# EAGLE schematic fit-test-2 (EAGLE 9.1.3)

## Sheet 1 of 5
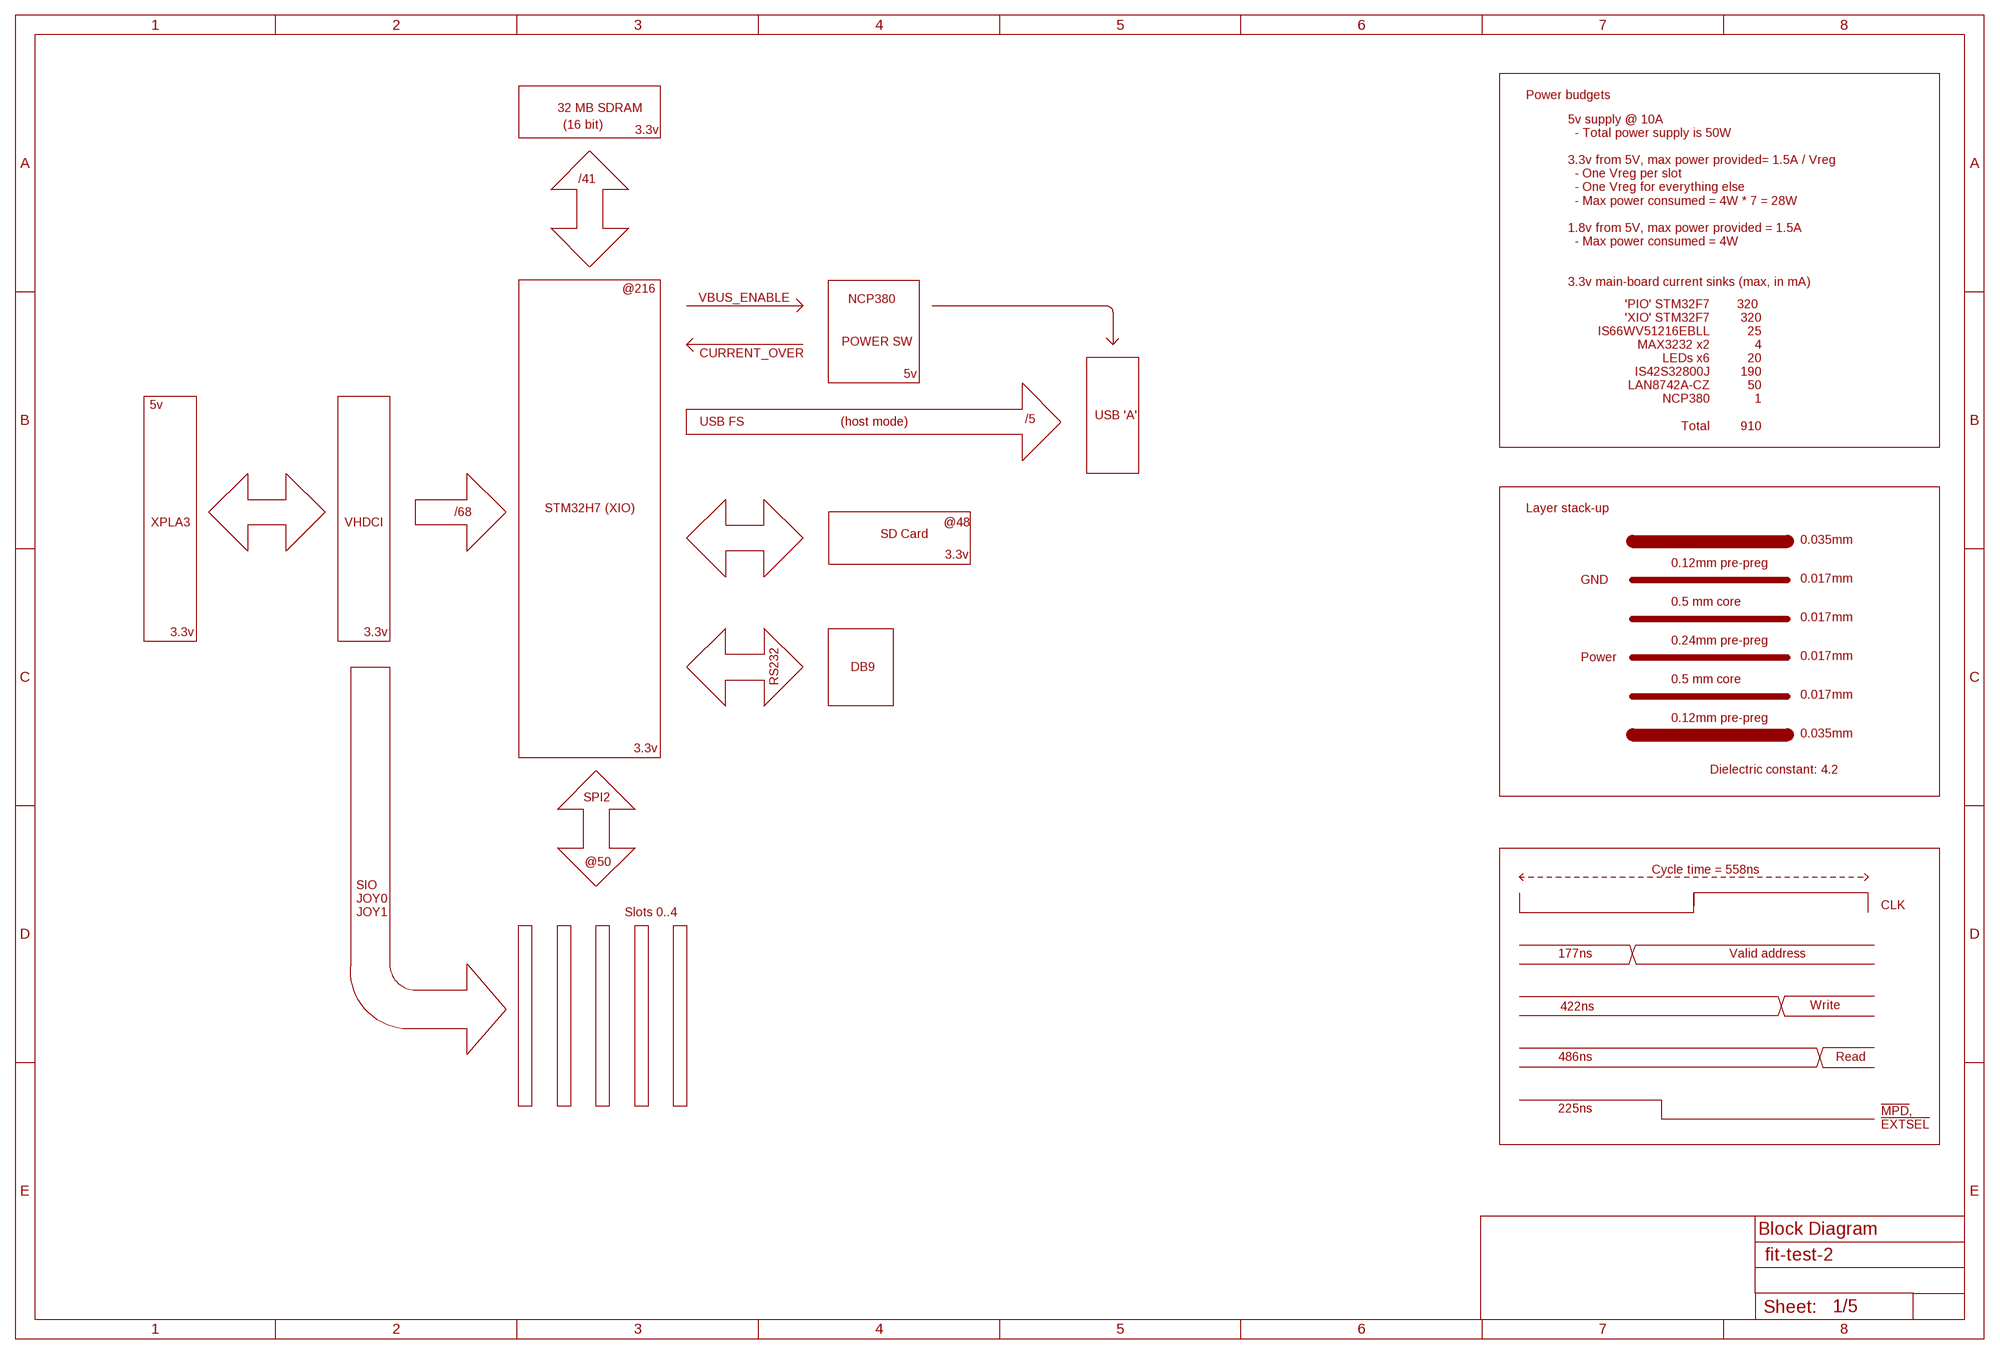
[diagram p0: schematic, sheet 1]

### Notes on the sheet
- Power budgets
- 32 MB SDRAM
- (16 bit)
- 3.3v
- /41
- 5v supply @ 10A
    - Total power supply is 50W
  
  3.3v from 5V, max power provided= 1.5A / Vreg
    - One Vreg per slot
    - One Vreg for everything else
    - Max power consumed = 4W * 7 = 28W 
  
  1.8v from 5V, max power provided = 1.5A
    - Max power consumed = 4W 
  
  
  3.3v main-board current sinks (max, in mA)
- @216 | VBUS_ENABLE
- 'PIO' STM32F7
  'XIO' STM32F7
  IS66WV51216EBLL
  MAX3232 x2
  LEDs x6
  IS42S32800J
  LAN8742A-CZ
  NCP380
  
  Total
- 320 
  320
  25
  4
  20
  190
  50
  1
  
  910
- NCP380
- POWER SW
- CURRENT_OVER
- 5v
- 5v
- USB 'A'
- USB FS | (host mode) | /5
- STM32H7 (XIO) | Layer stack-up
- /68
- XPLA3 | VHDCI | @48
- SD Card
- 0.035mm
- 3.3v
- 0.12mm pre-preg
- GND | 0.017mm
- 0.5 mm core
- 0.017mm
- 3.3v | 3.3v
- 0.24mm pre-preg
- Power | 0.017mm
- DB9
- RS232 | 0.5 mm core
- 0.017mm
- 0.12mm pre-preg
- 0.035mm
- 3.3v
- Dielectric constant: 4.2
- SPI2
- @50
- Cycle time = 558ns
- CLK
- SIO
  JOY0
  JOY1
- Slots 0..4
- 177ns | Valid address
- 422ns | Write
- 486ns | Read
- 225ns
- !MPD!,
  !EXTSEL!
- Block Diagram

## Sheet 2 of 5: XIO Power
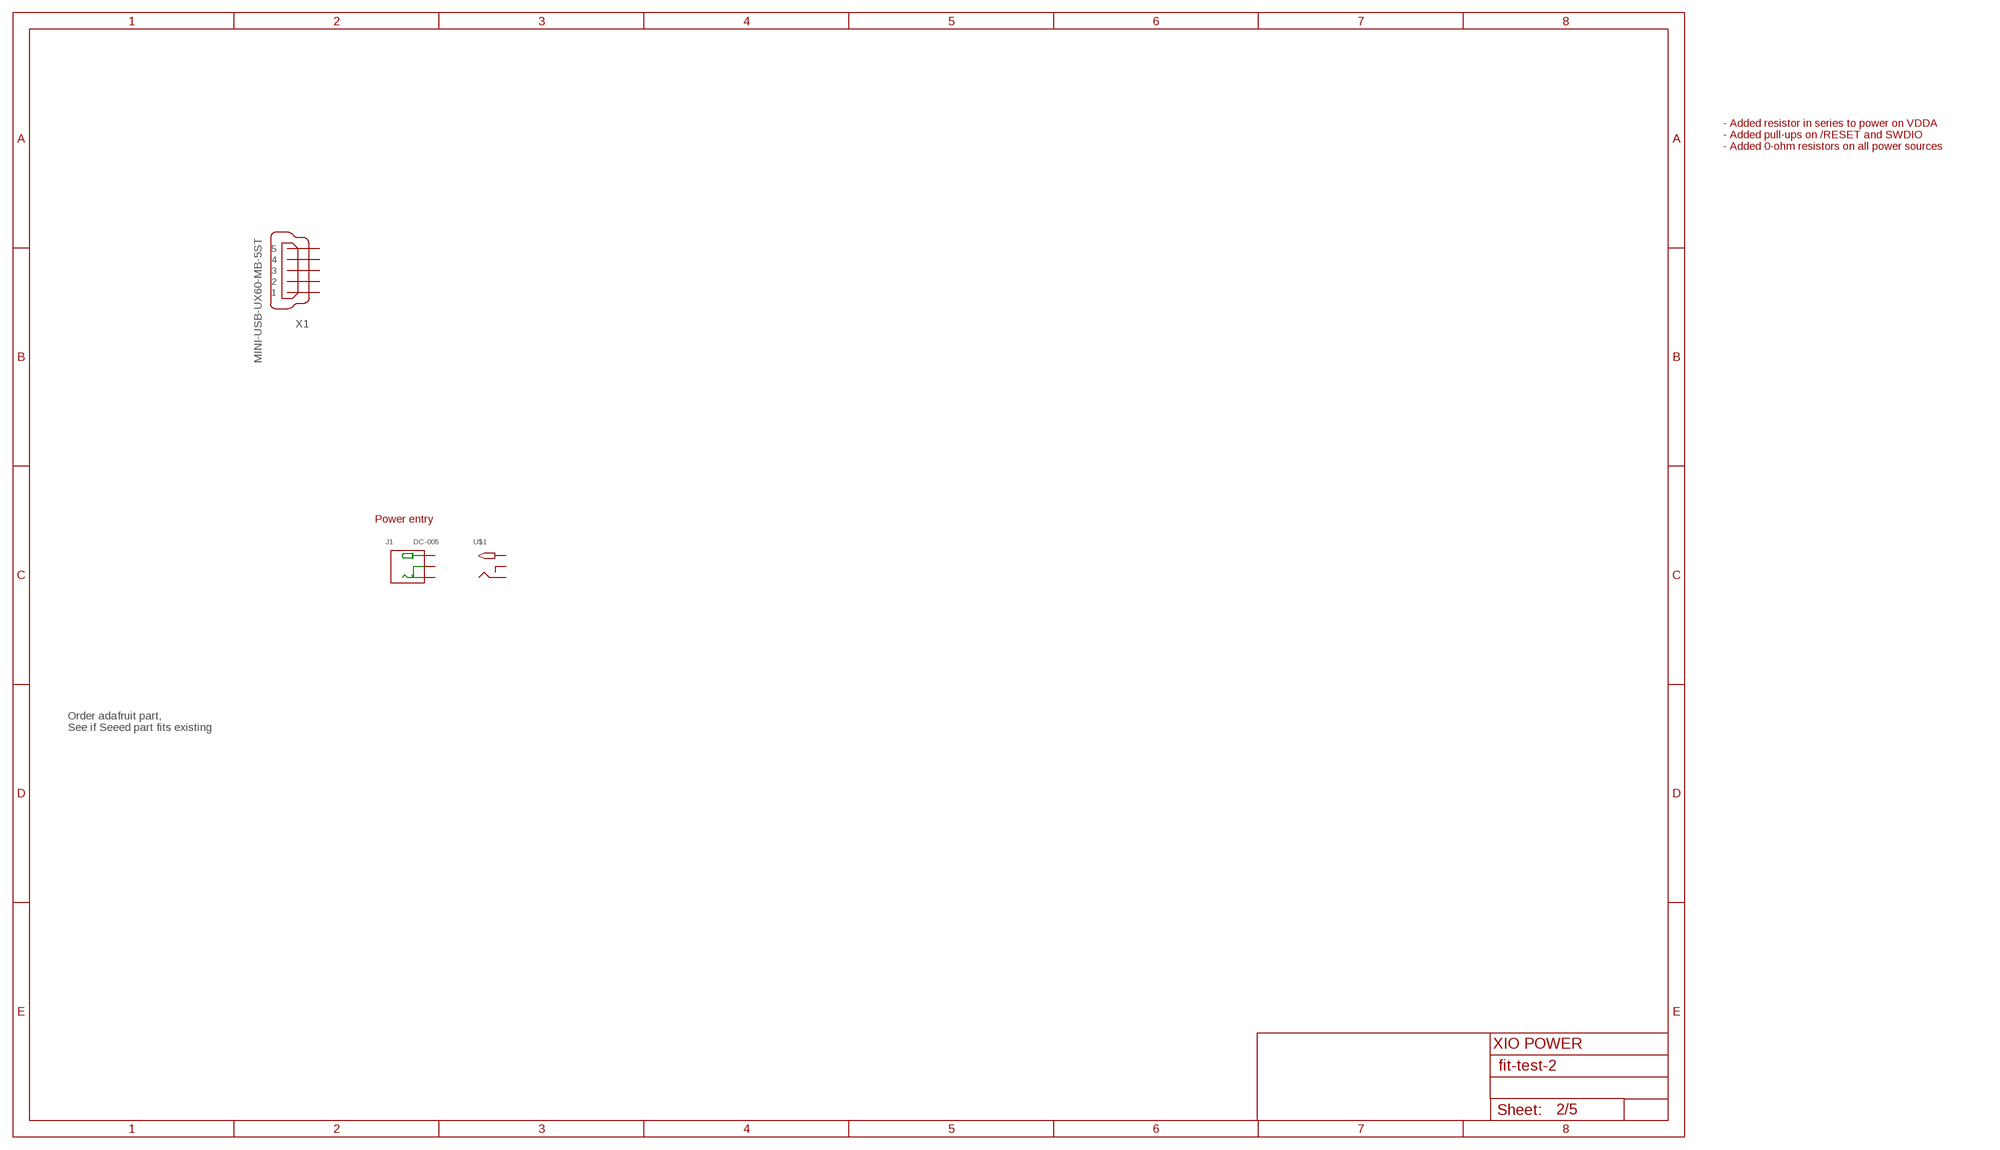
[diagram p1: schematic, sheet 2]

### Parts
J1  DC-005  CONN-POWER-JACK-2.1MM(DC-005)  [DCJ3P-14.2X11.0X9.0MM]
U$1  2.1MMJACKSMT  [DCJACK_2MM_SMT]
X1  MINI-USB-UX60-MB-5ST  [UX60-MB-5ST]
Unconnected: J1.+ J1.-1(-) J1.-2(CDN) U$1.GND(RING) U$1.GNDBREAK(RING_SW) U$1.PWR2(TIP) X1.1 X1.2 X1.3 X1.4 X1.5

### Notes on the sheet
- - Added resistor in series to power on VDDA
  - Added pull-ups on /RESET and SWDIO
  - Added 0-ohm resistors on all power sources
- Power entry
- Order adafruit part, 
  See if Seeed part fits existing
- XIO POWER

## Sheet 3 of 5: XIO VHDCI interface
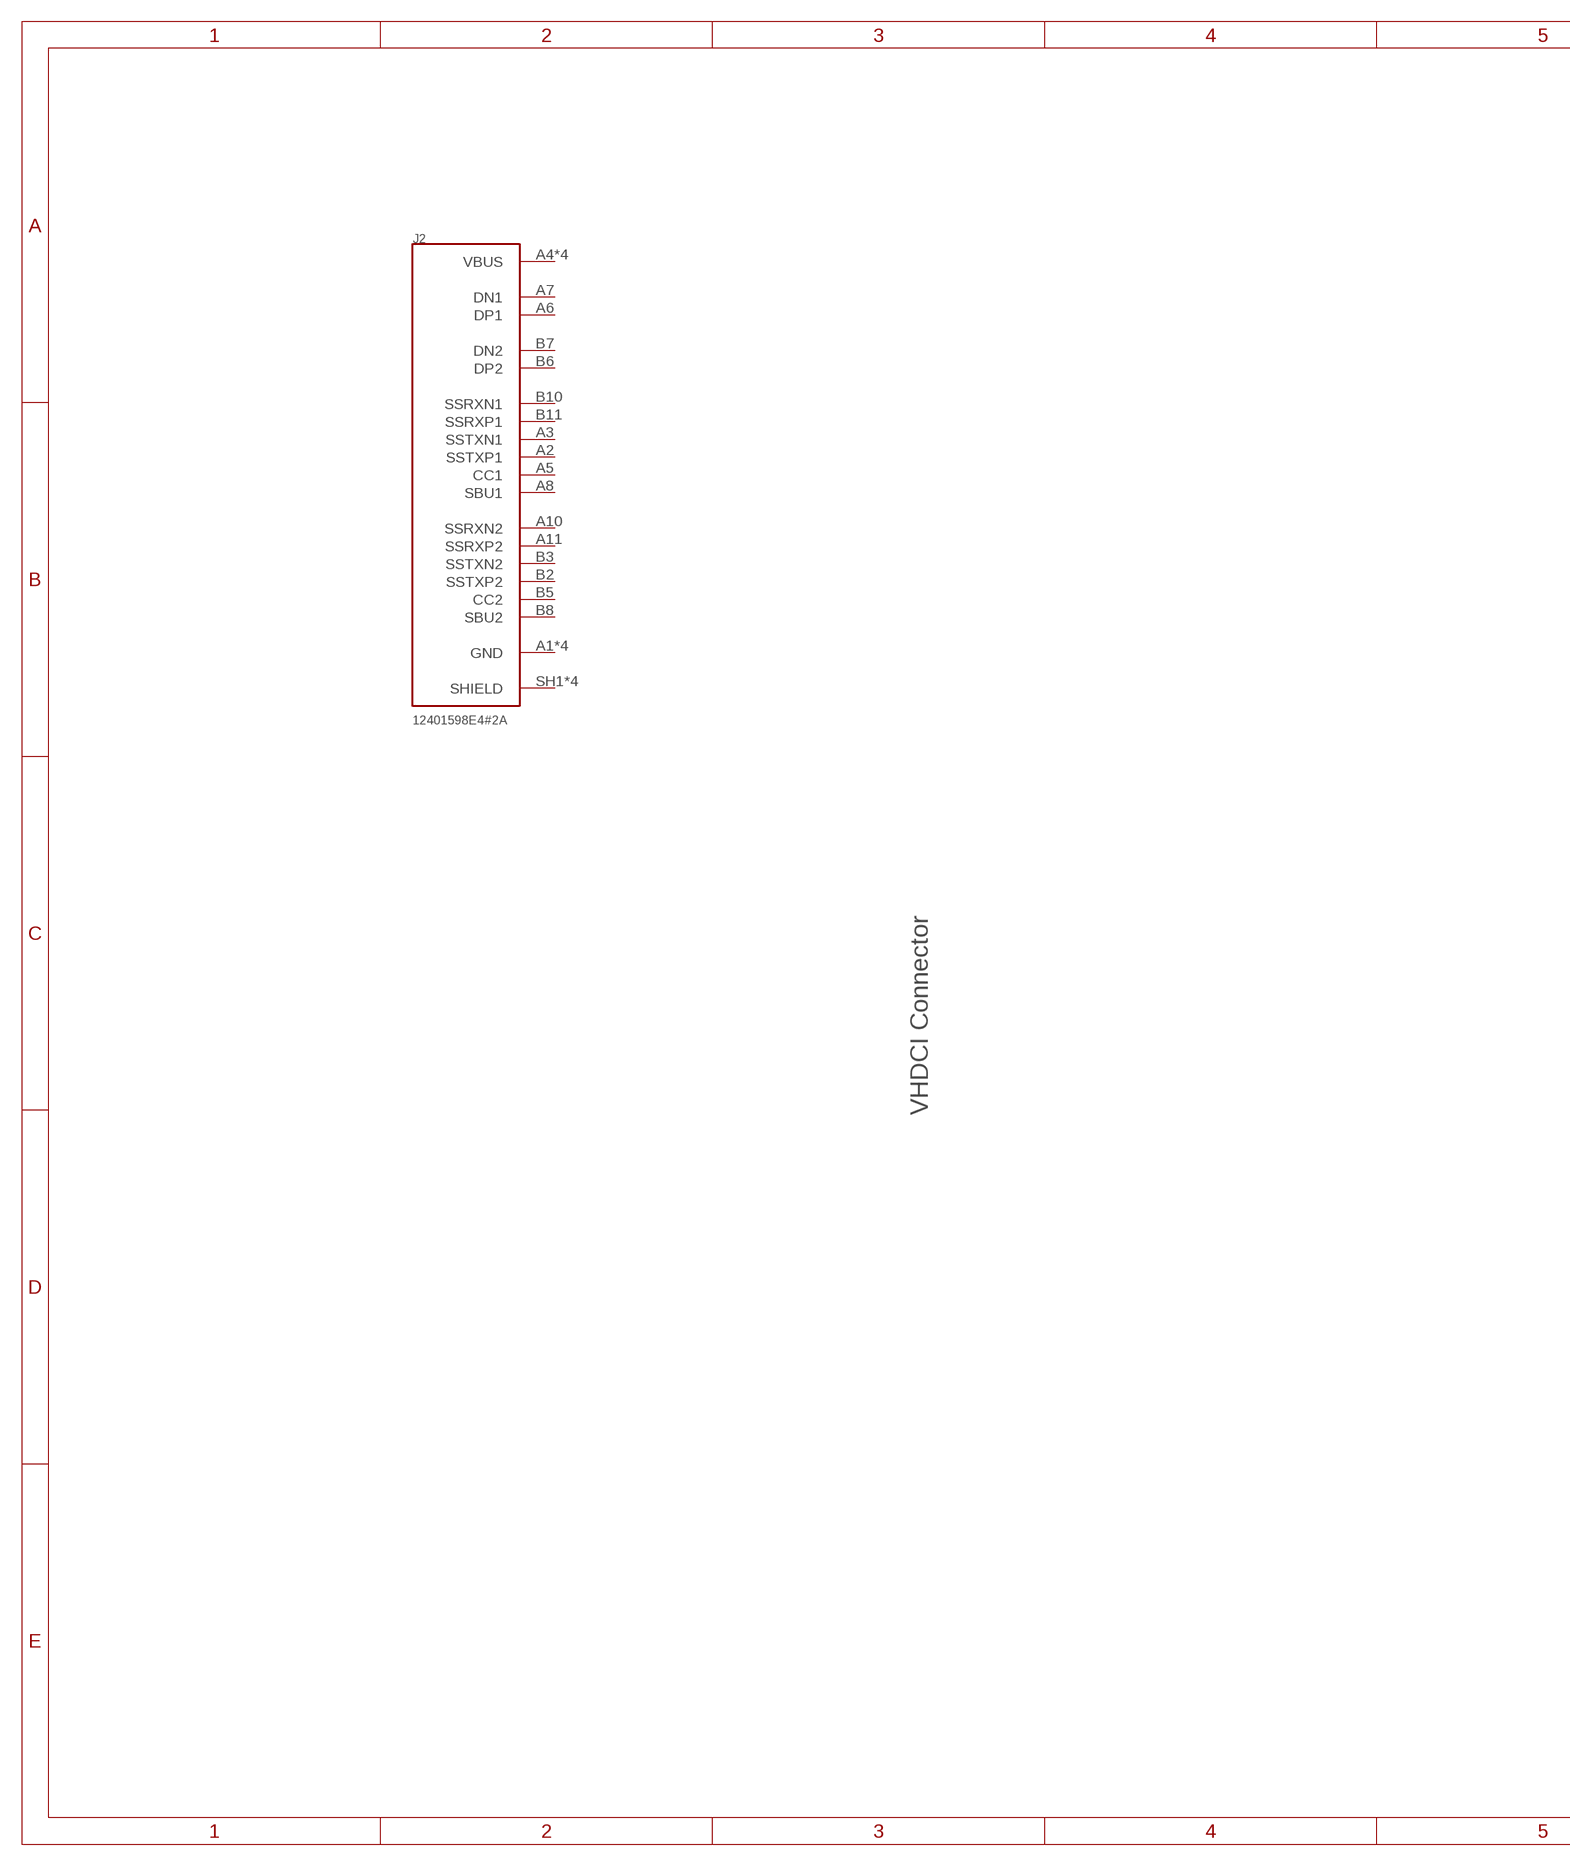
[diagram p2: schematic, sheet 3, part 1 of 2]
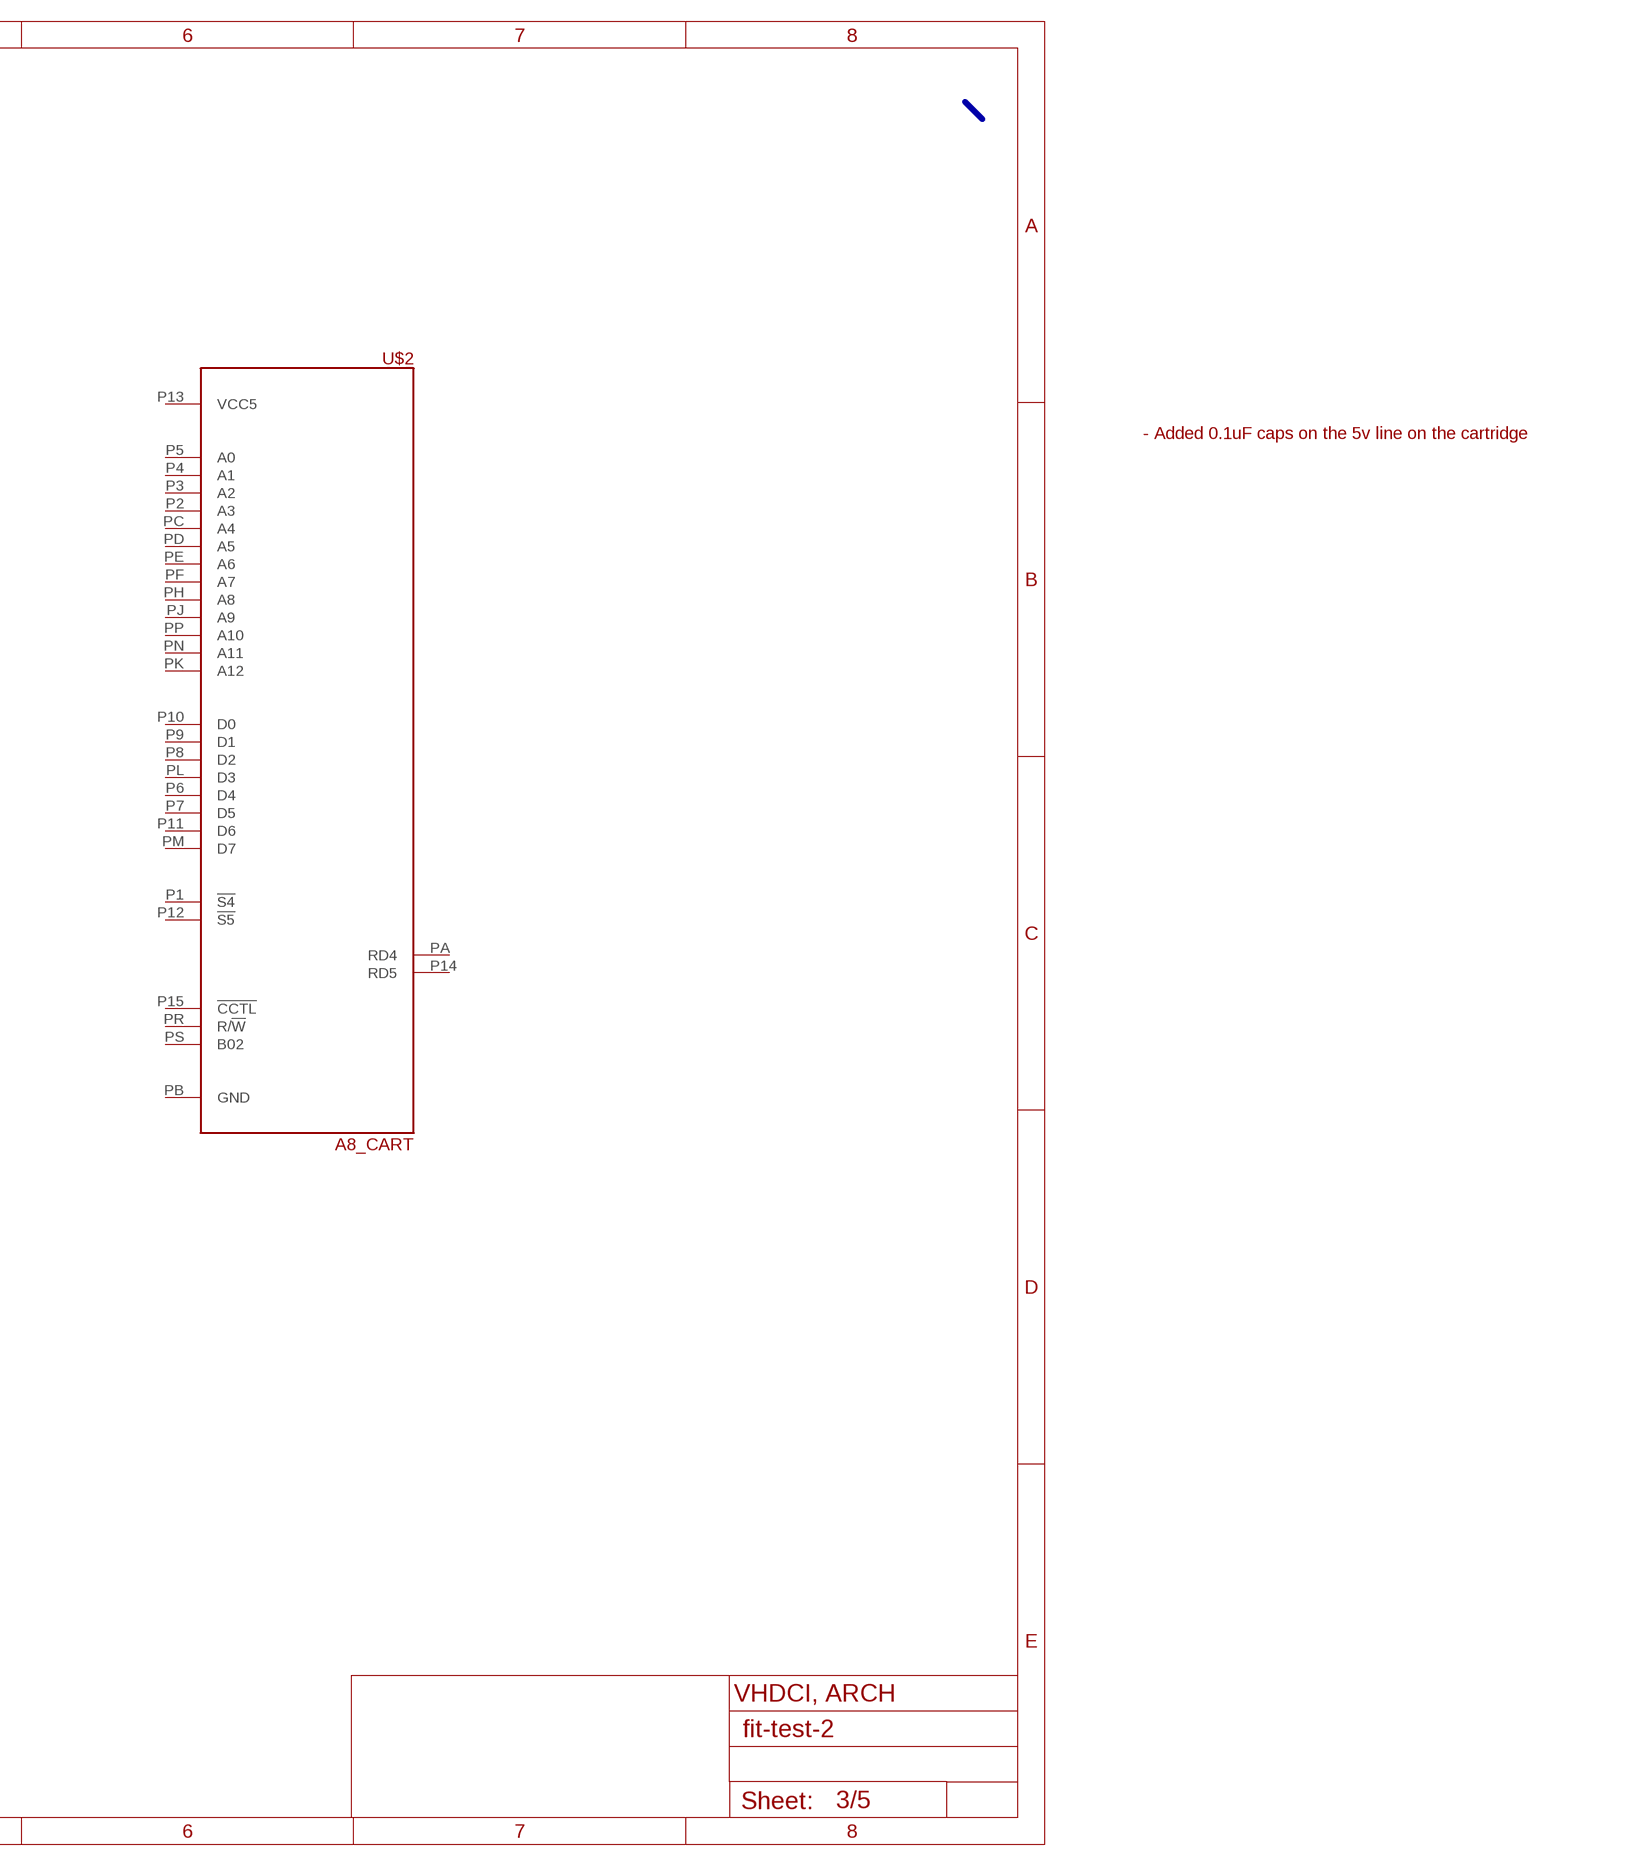
[diagram p3: schematic, sheet 3, part 2 of 2]

### Parts
J2  12401598E4#2A  [AMPHENOL_12401598E4#2A]
U$2  A8_CART  [A8_CART]
Unconnected: J2.A1(GND) J2.A2(SSTXP1) J2.A3(SSTXN1) J2.A4(VBUS) J2.A5(CC1) J2.A6(DP1) J2.A7(DN1) J2.A8(SBU1) J2.A9(VBUS) J2.A10(SSRXN2) J2.A11(SSRXP2) J2.A12(GND) J2.B1(GND) J2.B2(SSTXP2) J2.B3(SSTXN2) J2.B4(VBUS) J2.B5(CC2) J2.B6(DP2) J2.B7(DN2) J2.B8(SBU2) J2.B9(VBUS) J2.B10(SSRXN1) J2.B11(SSRXP1) J2.B12(GND) J2.SH1(SHIELD) J2.SH2(SHIELD) J2.SH3(SHIELD) J2.SH4(SHIELD) U$2.P1(!S4!) U$2.P2(A3) U$2.P3(A2) U$2.P4(A1) U$2.P5(A0) U$2.P6(D4) U$2.P7(D5) U$2.P8(D2) U$2.P9(D1) U$2.P10(D0) U$2.P11(D6) U$2.P12(!S5!) U$2.P13(VCC5) U$2.P14(RD5) U$2.P15(!CCTL!) U$2.PA(RD4) U$2.PB(GND) U$2.PC(A4) U$2.PD(A5) U$2.PE(A6) U$2.PF(A7) U$2.PH(A8) U$2.PJ(A9) U$2.PK(A12) U$2.PL(D3) U$2.PM(D7) U$2.PN(A11) U$2.PP(A10) U$2.PR(R/!W!) U$2.PS(B02)

### Buses
VHDCI:VHDCI_A[0..15],VHDCI_AUDIO_L,VHDCI_AUDIO_R,VHDCI_AUDIO_SIO,VHDCI_CCTL,VHDCI_CLK,VHDCI_COMMAND,VHDCI_D[0..7],VHDCI_D1XX,VHDCI_DATA_OUT,!VHDCI_EXSEL!,VHDCI_GND,VHDCI_HALT,!VHDCI_IRQ!,VHDCI_J1_[1..5],VHDCI_J1_A1,VHDCI_J1_A2,VHDCI_J2_[1..5],VHDCI_J2_A1,VHDCI_J2_A2,!VHDCI_MPD!,VHDCI_MTR_CTRL,VHDCI_RD4,VHDCI_RD5,VHDCI_REF,VHDCI_RSRVD[0..6],VHDCI_RST,VHDCI_RW,VHDCI_S4,VHDCI_S5,VHDCI_SIO_CLK_IN,VHDCI_SIO_DATA_IN

### Notes on the sheet
- - Added 0.1uF caps on the 5v line on the cartridge
- VHDCI Connector
- VHDCI, ARCH

## Sheet 4 of 5: XIO Serial I/O
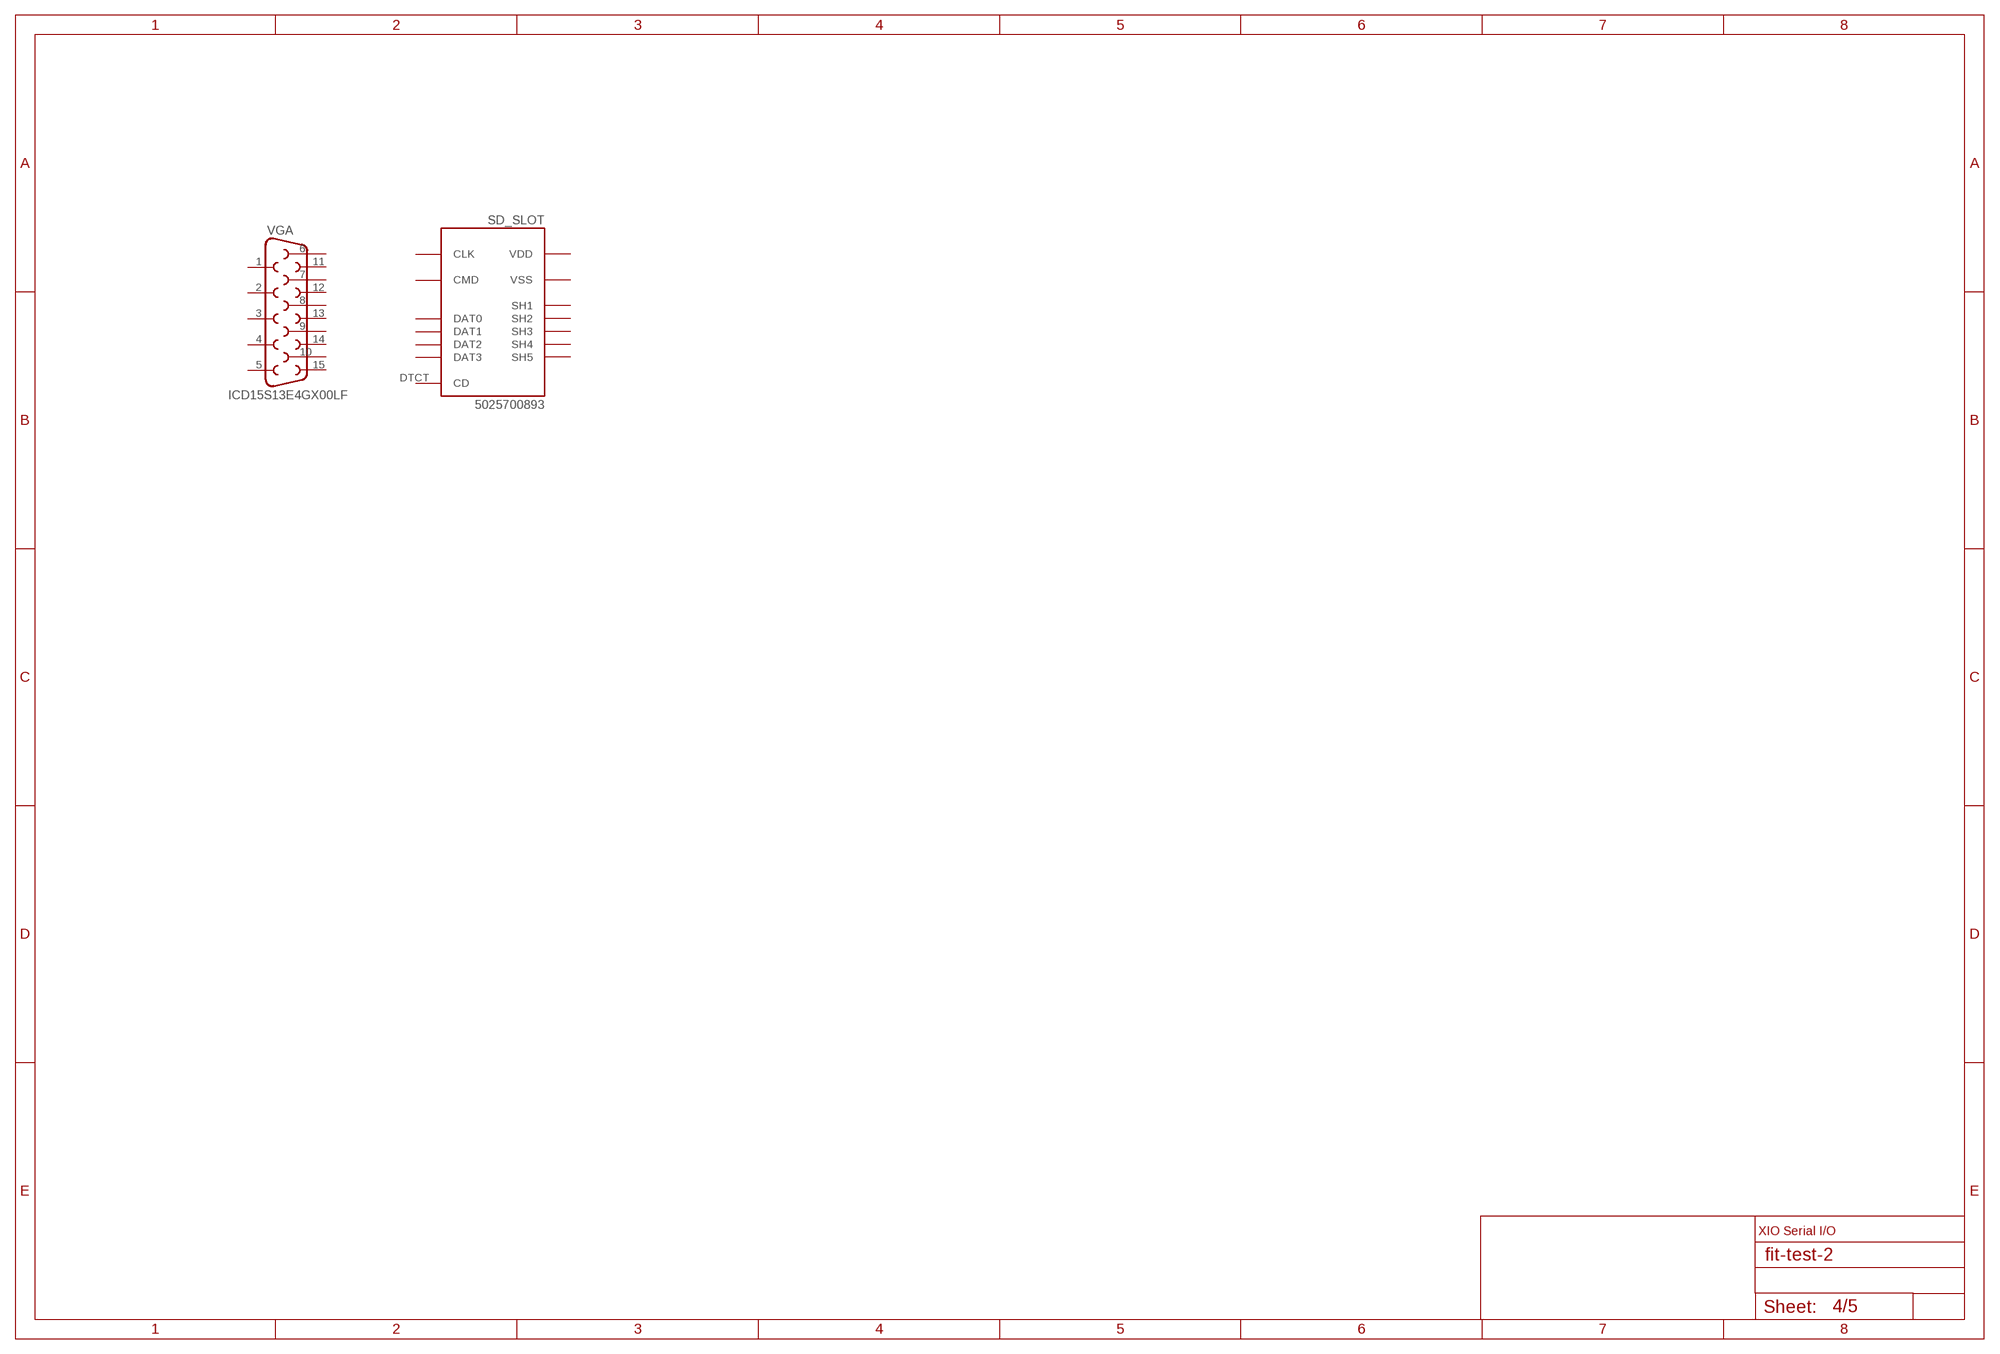
[diagram p4: schematic, sheet 4]

### Parts
SD_SLOT  5025700893  MICROSD_MOLEX_5025700893  [5025700893]
VGA  ICD15S13E4GX00LF  DB15  [DB15]
Unconnected: SD_SLOT.DTCT(CD) SD_SLOT.P$1(DAT2) SD_SLOT.P$2(DAT3) SD_SLOT.P$3(CMD) SD_SLOT.P$5(CLK) SD_SLOT.P$7(DAT0) SD_SLOT.P$8(DAT1) VGA.1 VGA.2 VGA.3 VGA.4 VGA.5 VGA.6 VGA.7 VGA.8 VGA.9 VGA.10 VGA.11 VGA.12 VGA.13 VGA.14 VGA.15

### Notes on the sheet
- XIO Serial I/O

## Sheet 5 of 5: XIO USB Host only
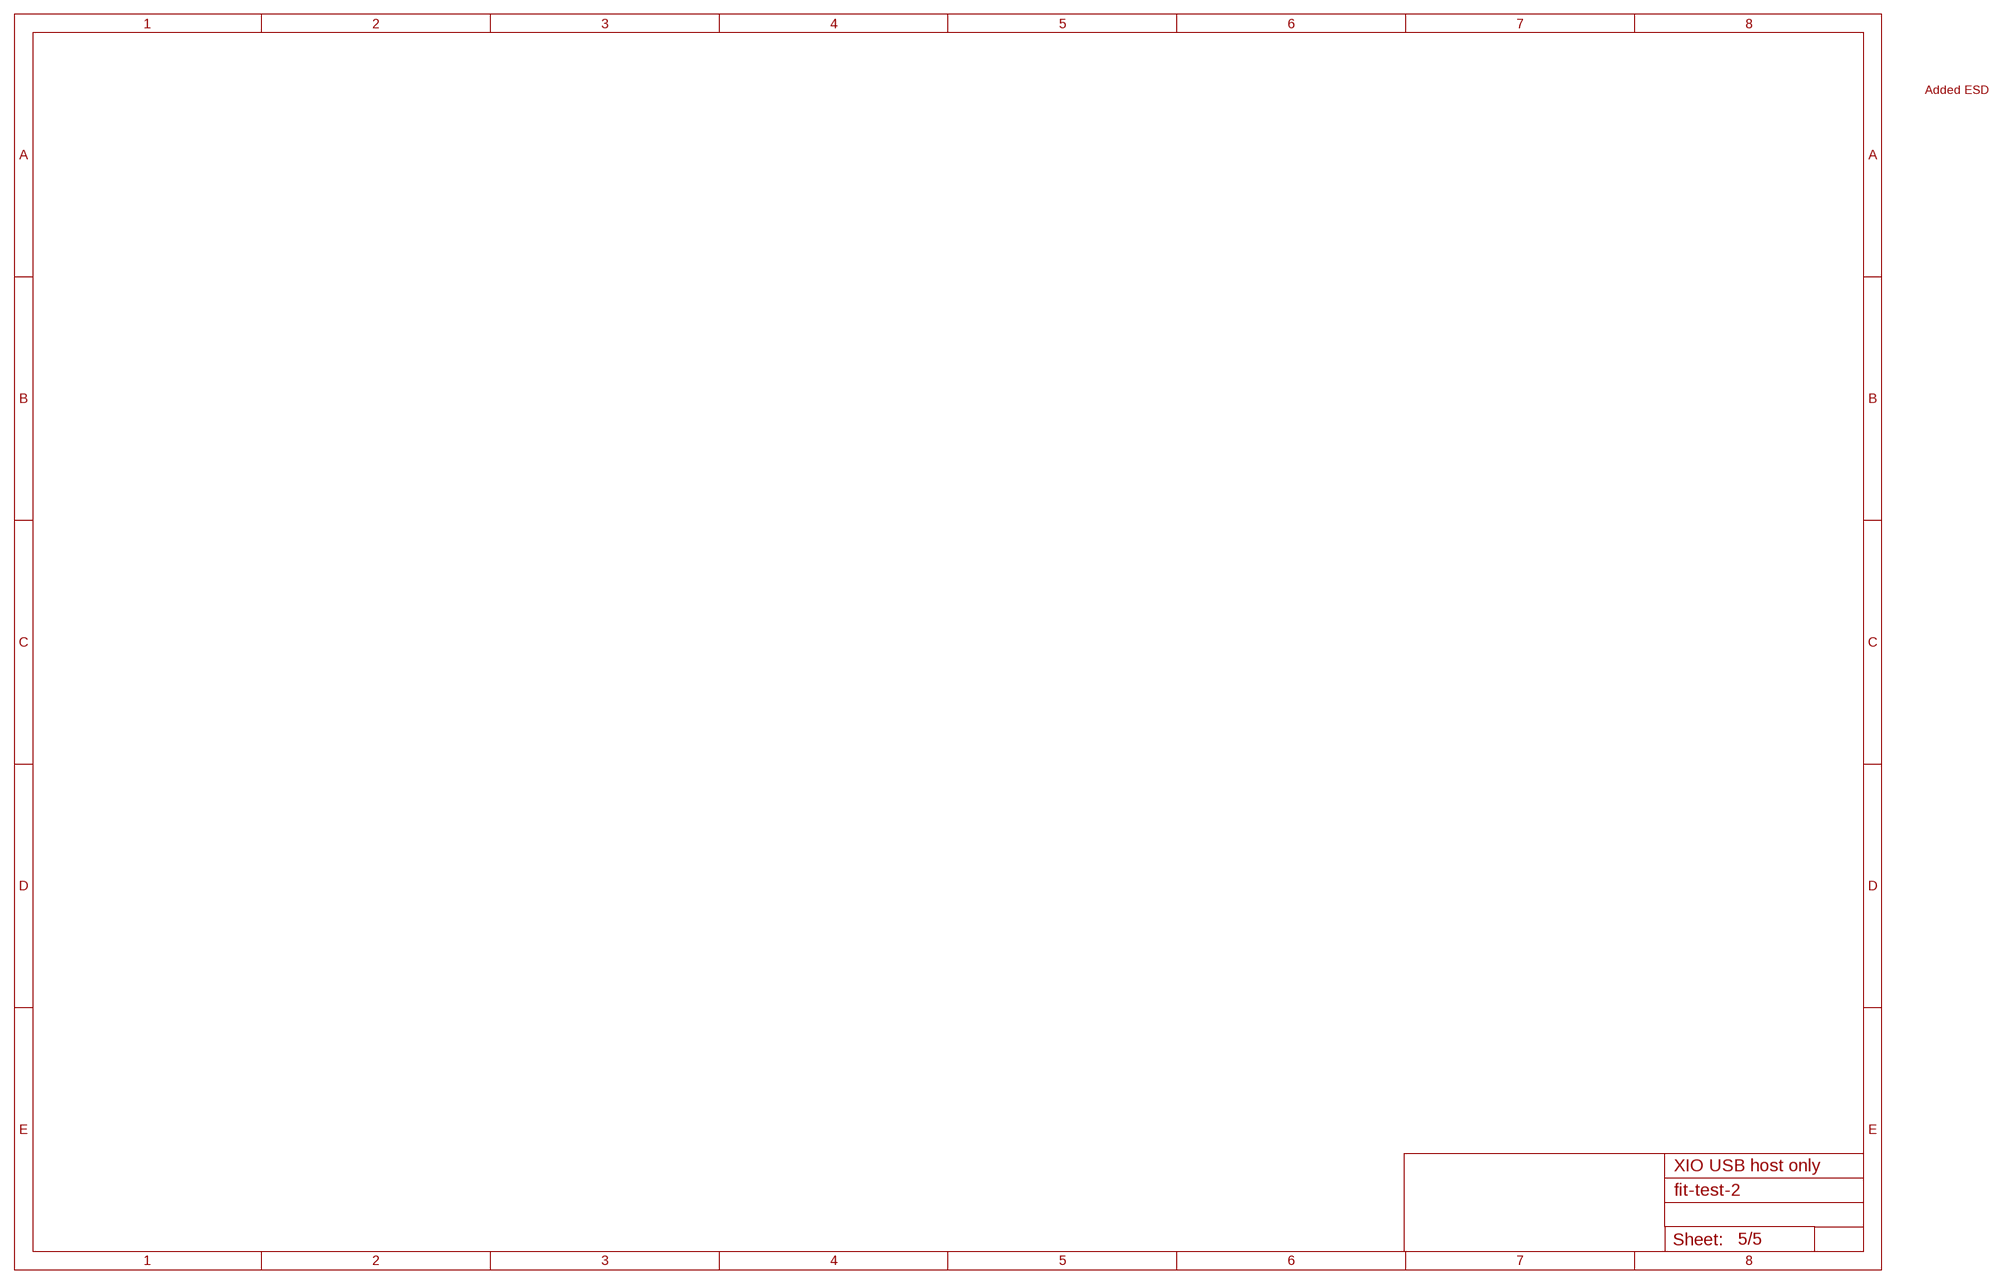
[diagram p5: schematic, sheet 5]

### Notes on the sheet
- Added ESD
- XIO USB host only

## Power pins joined to a net without a drawn wire
SH1: SD_SLOT.GND0(SH1)
SH2: SD_SLOT.GND1(SH2)
SH3: SD_SLOT.GND2(SH3)
SH4: SD_SLOT.GND3(SH4)
SH5: SD_SLOT.GND4(SH5)
VDD: SD_SLOT.P$4(VDD)
VSS: SD_SLOT.P$6(VSS)

## Library data of the parts
J1 = Seeed-Connector:CONN-POWER-JACK-2.1MM(DC-005): 320120003; MPN: DC-005
J2 = usb-c:12401598E4#2A: Usb Jack 3.1, C Type, 24 Pin, Ho; AVAILABILITY: Unavailable; DESCRIPTION: Usb Type C / Tape & Reel; MF: Amphenol Commercial; MP: 12401598E4#2A; PACKAGE: None; PRICE: None
SD_SLOT = j_microsd_molex_5025700893:MICROSD_MOLEX_5025700893: Molex 5025700893 MicroSD Normal Mount SMT Connector
U$1 = adafruit:2.1MMJACK: 2.1mm x 5.5mm THM DC jack with internal switch. Digikey part #PJ-102A, 4UCON part #05537 2.1mm x 5.5mm SMT DC jack with internal switch. Digikey part #PJ-002A-SMT, 4UCON part #03267 By microbuilder.eu & adafruit.com
U$2 = sjg-con:A8_CART
VGA = SparkFun-Connectors:DB15: DB15 / VGA right angle through-hole female connector.
X1 = con-hirose:MINI-USB-: MINI USB Connector Source: http://www.hirose.co.jp/cataloge_hp/e24000019.pdf; OC_FARNELL: unknown; OC_NEWARK: unknown

## Net classes
1 Power: width 0.305 mm, drill 0.203 mm
2 Slot-power: width 0.508 mm
3 tx100: width 0.254 mm, clearance 0.457 mm
4 usb90: width 0.508 mm, clearance 0.61 mm